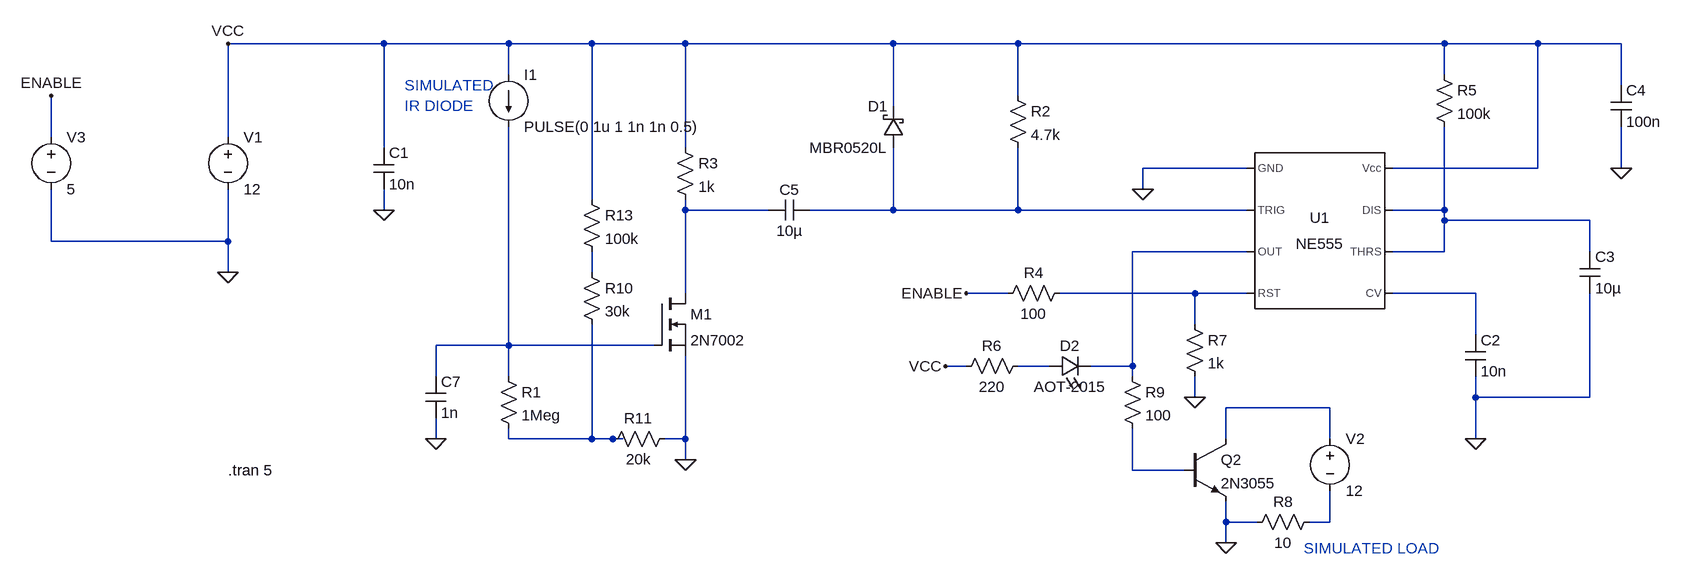
[diagram p0: schematic target.asc]
target.asc, the LTspice schematic file:
Version 4
SHEET 1 2360 680
WIRE -48 -208 -288 -208
WIRE 144 -208 -48 -208
WIRE 272 -208 144 -208
WIRE 416 -208 272 -208
WIRE 736 -208 416 -208
WIRE 928 -208 736 -208
WIRE 1584 -208 928 -208
WIRE 1728 -208 1584 -208
WIRE 1856 -208 1728 -208
WIRE 144 -160 144 -208
WIRE 1584 -160 1584 -208
WIRE 1856 -144 1856 -208
WIRE 928 -128 928 -208
WIRE 736 -112 736 -208
WIRE -560 -64 -560 -128
WIRE -288 -64 -288 -208
WIRE -48 -48 -48 -208
WIRE 416 -48 416 -208
WIRE 1280 -16 1120 -16
WIRE 1728 -16 1728 -208
WIRE 1728 -16 1504 -16
WIRE 1856 -16 1856 -80
WIRE 1120 16 1120 -16
WIRE 272 32 272 -208
WIRE -48 48 -48 16
WIRE 416 48 416 32
WIRE 544 48 416 48
WIRE 736 48 736 -48
WIRE 736 48 608 48
WIRE 928 48 928 -48
WIRE 928 48 736 48
WIRE 1280 48 928 48
WIRE 1584 48 1584 -80
WIRE 1584 48 1504 48
WIRE 1584 64 1584 48
WIRE 1808 64 1584 64
WIRE -560 96 -560 16
WIRE -288 96 -288 16
WIRE -288 96 -560 96
WIRE 1280 112 1104 112
WIRE 1584 112 1584 64
WIRE 1584 112 1504 112
WIRE 1808 112 1808 64
WIRE -288 144 -288 96
WIRE 272 144 272 112
WIRE 416 176 416 48
WIRE 912 176 848 176
WIRE 1200 176 992 176
WIRE 1280 176 1200 176
WIRE 1632 176 1504 176
WIRE 1200 224 1200 176
WIRE 1632 240 1632 176
WIRE 144 256 144 -80
WIRE 144 256 32 256
WIRE 368 256 144 256
WIRE 848 288 816 288
WIRE 976 288 928 288
WIRE 1104 288 1104 112
WIRE 1104 288 1040 288
WIRE 32 304 32 256
WIRE 144 304 144 256
WIRE 1104 304 1104 288
WIRE 1200 336 1200 304
WIRE 1632 336 1632 304
WIRE 1808 336 1808 176
WIRE 1808 336 1632 336
WIRE 1408 352 1248 352
WIRE 32 400 32 368
WIRE 144 400 144 384
WIRE 272 400 272 224
WIRE 272 400 144 400
WIRE 304 400 272 400
WIRE 320 400 304 400
WIRE 416 400 416 272
WIRE 416 400 384 400
WIRE 1248 400 1248 352
WIRE 1408 400 1408 352
WIRE 1632 400 1632 336
WIRE 416 432 416 400
WIRE 1104 448 1104 384
WIRE 1184 448 1104 448
WIRE 1248 528 1248 496
WIRE 1296 528 1248 528
WIRE 1408 528 1408 480
WIRE 1408 528 1376 528
WIRE 1248 560 1248 528
FLAG -48 48 0
FLAG 416 432 0
FLAG -288 144 0
FLAG 1120 16 0
FLAG 1632 400 0
FLAG 1856 -16 0
FLAG 1248 560 0
FLAG -560 -128 ENABLE
FLAG -288 -208 VCC
FLAG 816 288 VCC
FLAG 1200 336 0
FLAG 848 176 ENABLE
FLAG 32 400 0
SYMBOL cap -64 -48 R0
SYMATTR InstName C1
SYMATTR Value 10n
SYMBOL nmos 368 176 R0
SYMATTR InstName M1
SYMATTR Value 2N7002
SYMBOL voltage -288 -80 R0
WINDOW 123 0 0 Left 0
WINDOW 39 0 0 Left 0
SYMATTR InstName V1
SYMATTR Value 12
SYMBOL res 400 -64 R0
SYMATTR InstName R3
SYMATTR Value 1k
SYMBOL Misc\\NE555 1392 80 R0
SYMATTR InstName U1
SYMBOL cap 1616 240 R0
SYMATTR InstName C2
SYMATTR Value 10n
SYMBOL res 1568 -176 R0
SYMATTR InstName R5
SYMATTR Value 100k
SYMBOL cap 1792 112 R0
SYMATTR InstName C3
SYMATTR Value 10µ
SYMBOL res 128 288 R0
SYMATTR InstName R1
SYMATTR Value 1Meg
SYMBOL current 144 -160 R0
WINDOW 123 0 0 Left 0
WINDOW 39 0 0 Left 0
SYMATTR InstName I1
SYMATTR Value PULSE(0 1u 1 1n 1n 0.5)
SYMBOL cap 1840 -144 R0
SYMATTR InstName C4
SYMATTR Value 100n
SYMBOL cap 608 32 R90
WINDOW 0 0 32 VBottom 2
WINDOW 3 32 32 VTop 2
SYMATTR InstName C5
SYMATTR Value 10µ
SYMBOL schottky 752 -48 R180
WINDOW 0 24 64 Left 2
WINDOW 3 24 0 Left 2
SYMATTR InstName D1
SYMATTR Value MBR0520L
SYMATTR Description Diode
SYMATTR Type diode
SYMBOL npn 1184 400 R0
SYMATTR InstName Q2
SYMATTR Value 2N3055
SYMBOL res 1088 288 R0
SYMATTR InstName R9
SYMATTR Value 100
SYMBOL voltage 1408 384 R0
WINDOW 123 0 0 Left 0
WINDOW 39 0 0 Left 0
SYMATTR InstName V2
SYMATTR Value 12
SYMBOL res 1392 512 R90
WINDOW 0 0 56 VBottom 2
WINDOW 3 32 56 VTop 2
SYMATTR InstName R8
SYMATTR Value 10
SYMBOL voltage -560 -80 R0
WINDOW 123 0 0 Left 0
WINDOW 39 0 0 Left 0
SYMATTR InstName V3
SYMATTR Value 5
SYMBOL res 1008 160 R90
WINDOW 0 0 56 VBottom 2
WINDOW 3 32 56 VTop 2
SYMATTR InstName R4
SYMATTR Value 100
SYMBOL res 912 -144 R0
SYMATTR InstName R2
SYMATTR Value 4.7k
SYMBOL LED 976 304 R270
WINDOW 0 32 32 VTop 2
WINDOW 3 0 32 VBottom 2
SYMATTR InstName D2
SYMATTR Value AOT-2015
SYMATTR Description Diode
SYMATTR Type diode
SYMBOL res 944 272 R90
WINDOW 0 0 56 VBottom 2
WINDOW 3 32 56 VTop 2
SYMATTR InstName R6
SYMATTR Value 220
SYMBOL cap 16 304 R0
SYMATTR InstName C7
SYMATTR Value 1n
SYMBOL res 1184 208 R0
SYMATTR InstName R7
SYMATTR Value 1k
SYMBOL res 256 128 R0
SYMATTR InstName R10
SYMATTR Value 30k
SYMBOL res 400 384 R90
WINDOW 0 0 56 VBottom 2
WINDOW 3 32 56 VTop 2
SYMATTR InstName R11
SYMATTR Value 20k
SYMBOL res 256 16 R0
SYMATTR InstName R13
SYMATTR Value 100k
TEXT -288 448 Left 2 !.tran 5
TEXT -16 -144 Left 2 ;SIMULATED\nIR DIODE
TEXT 1368 568 Left 2 ;SIMULATED LOAD

The netlist it stands for:
* target.asc
C1 VCC 0 10n
M1 N001 N008 0 0 2N7002
V1 VCC 0 12
R3 VCC N001 1k
XU1 0 N002 N004 N006 N007 N003 N003 VCC NE555  ; pins GND TRIG OUT RST CV THRS DIS Vcc
C2 N007 0 10n
R5 VCC N003 100k
C3 N003 0 10µ
R1 N008 N011 1Meg
I1 VCC N008 PULSE(0 1u 1 1n 1n 0.5)
C4 VCC 0 100n
C5 N002 N001 10µ
D1 N002 VCC MBR0520L
Q2 N010 N012 0 0 2N3055
R9 N004 N012 100
V2 N010 N013 12
R8 N013 0 10
V3 ENABLE 0 5
R4 N006 ENABLE 100
R2 VCC N002 4.7k
D2 N009 N004 AOT-2015
R6 N009 VCC 220
C7 N008 0 1n
R7 N006 0 1k
R10 N005 N011 30k
R11 0 N011 20k
R13 VCC N005 100k
.model D D
.lib standard.dio
.model NPN NPN
.model PNP PNP
.lib standard.bjt
.model NMOS NMOS
.model PMOS PMOS
.lib standard.mos
.tran 5
* SIMULATED
* IR DIODE
* SIMULATED LOAD
.lib NE555.sub
.backanno
.end